# Altium schematic sheet EFR32_IO.SchDoc: IO Connections
size Letter; Author: Parth Thakkar; Organization: Low Self Esteam; Revision: v1.0; SheetNumber: 3; SheetTotal: 6
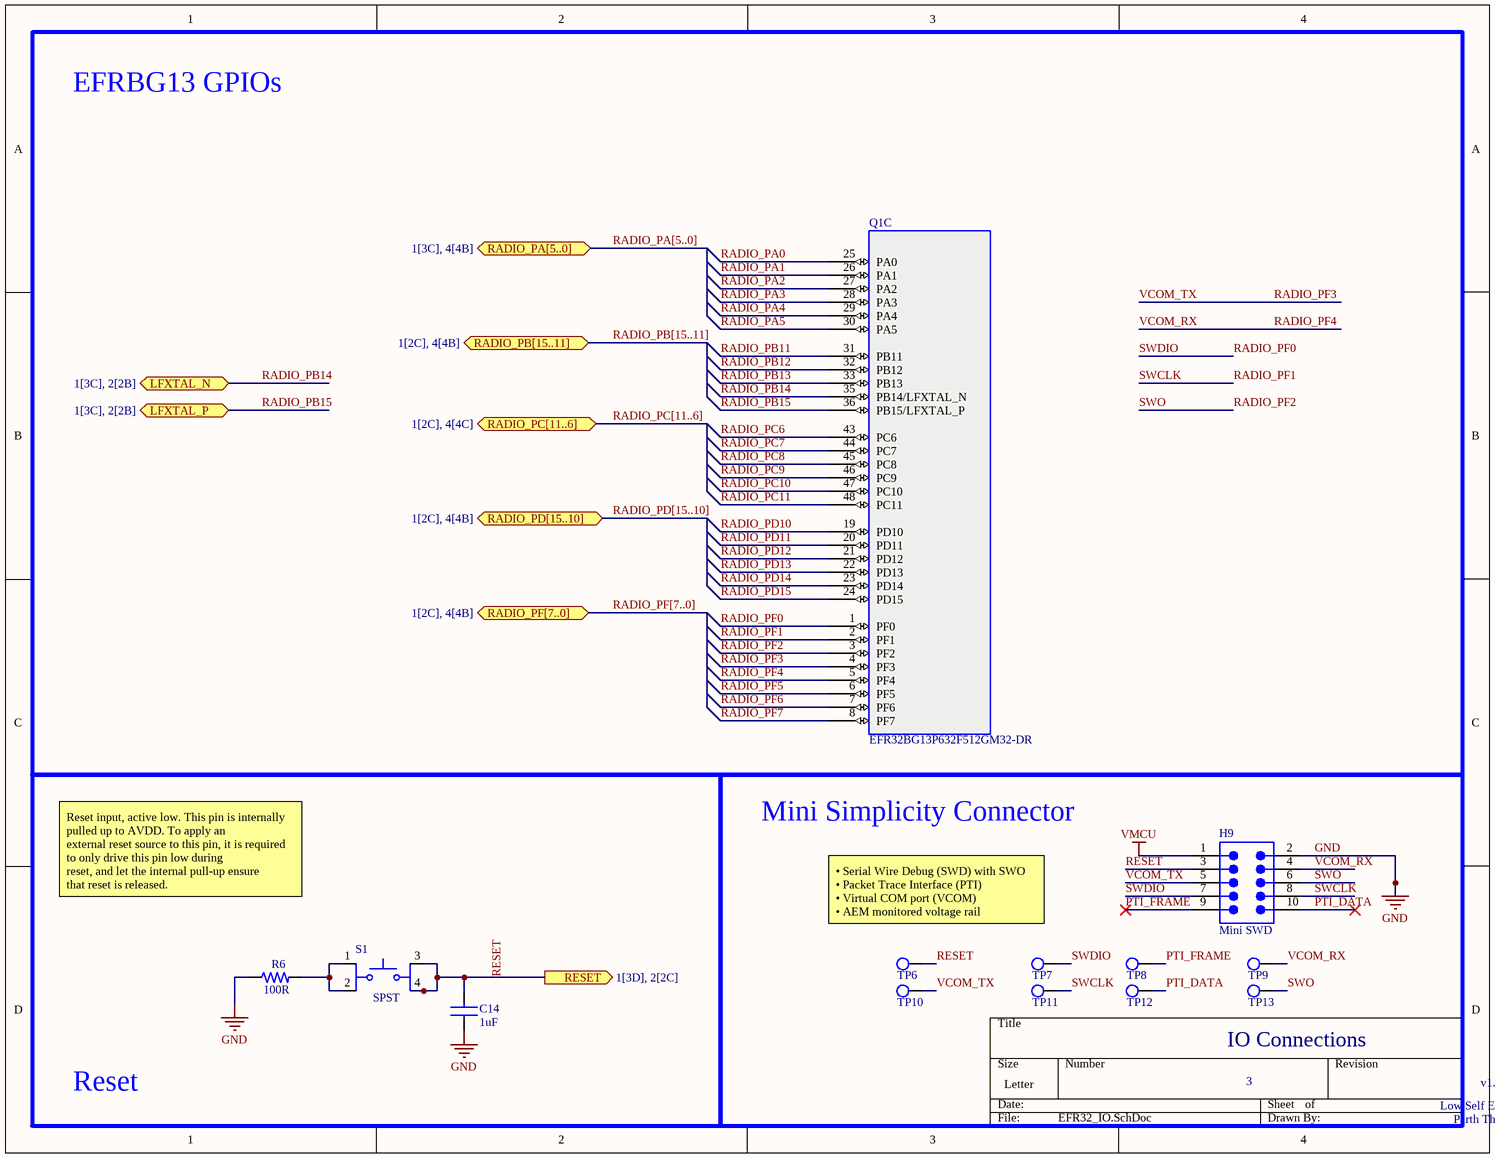
[diagram p0: EFR32_IO.SchDoc]

## Parts
C14  value 1uF  [Capacitor 0603]  (hidden comment: CAP 1uF 10V 0603)
H9  Mini SWD  [Mini Simplicity Connector]
Q1  EFR32BG13P632F512GM32-DR  [EFR32BG]  (part C of 3)
R6  value 100R  [Resistor 0603]  (hidden comment: RES 100R 0603)
S1  SPST  [SPST]
TP6  Test point  [Test Point]  (value not drawn)  (no BOM)
TP7  Test point  [Test Point]  (value not drawn)  (no BOM)
TP8  Test point  [Test Point]  (value not drawn)  (no BOM)
TP9  Test point  [Test Point]  (value not drawn)  (no BOM)
TP10  Test point  [Test Point]  (value not drawn)  (no BOM)
TP11  Test point  [Test Point]  (value not drawn)  (no BOM)
TP12  Test point  [Test Point]  (value not drawn)  (no BOM)
TP13  Test point  [Test Point]  (value not drawn)  (no BOM)

## Blocks framed on the sheet
EFRBG13 GPIOs: Q1
Reset: C14 R6 S1
Mini Simplicity Connector: H9 TP6-TP13

## Ports
LFXTAL_N (bidir, see 1[3C], 2[2B]), LFXTAL_P (bidir, see 1[3C], 2[2B]), RADIO_PA[5..0] (bidir, see 1[3C], 4[4B]), RADIO_PB[15..11] (bidir, see 1[2C], 4[4B]), RADIO_PC[11..6] (bidir, see 1[2C], 4[4C]), RADIO_PD[15..10] (bidir, see 1[2C], 4[4B]), RADIO_PF[7..0] (bidir, see 1[2C], 4[4B]), RESET (out, see 1[3D], 2[2C])

## Nets
GND: C14.2 H9.2 R6.1
VMCU: H9.1
PTI_DATA: H9.10 TP12.1
PTI_FRAME: H9.9 TP8.1
RADIO_PA0: Q1.25(PA0)
RADIO_PA1: Q1.26(PA1)
RADIO_PA2: Q1.27(PA2)
RADIO_PA3: Q1.28(PA3)
RADIO_PA4: Q1.29(PA4)
RADIO_PA5: Q1.30(PA5)
RADIO_PB11: Q1.31(PB11)
RADIO_PB12: Q1.32(PB12)
RADIO_PB13: Q1.33(PB13)
RADIO_PB14: Q1.35(PB14/LFXTAL_N) ; port LFXTAL_N
RADIO_PB15: Q1.36(PB15/LFXTAL_P) ; port LFXTAL_P
RADIO_PC6: Q1.43(PC6)
RADIO_PC7: Q1.44(PC7)
RADIO_PC8: Q1.45(PC8)
RADIO_PC9: Q1.46(PC9)
RADIO_PC10: Q1.47(PC10)
RADIO_PC11: Q1.48(PC11)
RADIO_PD10: Q1.19(PD10)
RADIO_PD11: Q1.20(PD11)
RADIO_PD12: Q1.21(PD12)
RADIO_PD13: Q1.22(PD13)
RADIO_PD14: Q1.23(PD14)
RADIO_PD15: Q1.24(PD15)
RADIO_PF0: H9.7 Q1.1(PF0) TP7.1  [also labelled SWDIO]
RADIO_PF1: H9.8 Q1.2(PF1) TP11.1  [also labelled SWCLK]
RADIO_PF2: H9.6 Q1.3(PF2) TP13.1  [also labelled SWO]
RADIO_PF3: H9.5 Q1.4(PF3) TP10.1  [also labelled VCOM_TX]
RADIO_PF4: H9.4 Q1.5(PF4) TP9.1  [also labelled VCOM_RX]
RADIO_PF5: Q1.6(PF5)
RADIO_PF6: Q1.7(PF6)
RADIO_PF7: Q1.8(PF7)
RESET: C14.1 H9.3 S1.3 S1.4 TP6.1 ; port RESET
NetR6_2: R6.2 S1.1 S1.2

## Buses and harness runs
bus RADIO_PA[5..0] = port RADIO_PA[5..0]
bus RADIO_PB[15..11] = port RADIO_PB[15..11]
bus RADIO_PC[11..6] = port RADIO_PC[11..6]
bus RADIO_PD[15..10] = port RADIO_PD[15..10]
bus RADIO_PF[7..0] = port RADIO_PF[7..0]

## Notes on the sheet
- Reset input, active low. This pin is internally
  pulled up to AVDD. To apply an
  external reset source to this pin, it is required
  to only drive this pin low during
  reset, and let the internal pull-up ensure
  that reset is released.
- • Serial Wire Debug (SWD) with SWO
  • Packet Trace Interface (PTI)
  • Virtual COM port (VCOM)
  • AEM monitored voltage rail

## Library data of the parts
C14 = CAP 1uF 10V 0603: Ceramic Capacitor, Multilayer, Ceramic, 10V, 10% +Tol, 10% -Tol, X5R, 15% TC, 1uF, Surface Mount, 0603; Manufacturer: Murata; Manufacturer Part Number: GRM188R61A105KA61D; Multilayer: Yes; Supplier: Digikey; Supplier Part Number: 490-1543-1-ND; RoHS: Yes; Category: Ceramic Capacitors; Stock: 2506225; Pricing: 1=0.1, 10=0.059, 50=0.0408, 100=0.0354, 500=0.0261, 1000=0.02321 (USD); Mounting Technology: Surface Mount; Pins: 2; Dielectric Material: Ceramic; Package Shape: Rectangular; Case/Package: 0603; Terminal Finish: Nickel; Min Operating Temperature: -55°C; Max Operating Temperature: 85°C; JESD-609 Code: e3; Capacitor Type: Ceramic; Tolerance  (fill in as +-): 10%; Package Style: SMTMeter; Packaging: Tape and Reel; Tolerance (fill in as +-): 10%; Rated DC Voltage (URdc): 10V; Temperature Characteristics Code: X5R; Termination: Wraparound; Length: 1.6mm; Width: 0.8mm; Height: 0.8mm; Reach SVHC Compliant: Yes; RoHS Compliant: Yes; ComponentLink1URL: https://psearch.en.murata.com:443/capacitor/product/GRM188R61A105KA61%23.pdf?src-supplier=IHS+Markit; ComponentLink1Description: https://psearch.en.murata.com:443/capacitor/product/GRM188R61A105KA61%23.pdf?src-supplier=IHS+Markit; ComponentLink2URL: https://datasheet.ciiva.com/18102/getdatasheetpartid-85467-18102910.pdf?src-supplier=Verical; ComponentLink2Description: https://datasheet.ciiva.com/18102/getdatasheetpartid-85467-18102910.pdf?src-supplier=Verical; ComponentLink3URL: https://datasheet.ciiva.com/19476/1857381-19476568.pdf?src-supplier=Jameco; ComponentLink3Description: https://datasheet.ciiva.com/19476/1857381-19476568.pdf?src-supplier=Jameco; ComponentLink4URL: https://datasheet.ciiva.com/7719/608985-7719036.pdf?src-supplier=Element14; ComponentLink4Description: https://datasheet.ciiva.com/7719/608985-7719036.pdf?src-supplier=Element14; ComponentLink5URL: https://datasheet.ciiva.com/22706/608985-22706782.pdf?src-supplier=Element14; ComponentLink5Description: https://datasheet.ciiva.com/22706/608985-22706782.pdf?src-supplier=Element14; ComponentLink6URL: https://datasheet.ciiva.com/131/partnumbering-e-01-131741.pdf?src-supplier=Digikey; ComponentLink6Description: https://datasheet.ciiva.com/131/partnumbering-e-01-131741.pdf?src-supplier=Digikey; ComponentLink7URL: https://datasheet.ciiva.com/131/partnumbering-e-01-131742.pdf?src-supplier=Digikey; ComponentLink7Description: https://datasheet.ciiva.com/131/partnumbering-e-01-131742.pdf?src-supplier=Digikey; ComponentLink8URL: https://datasheet.ciiva.com/131/partnumbering-e-01-131743.pdf?src-supplier=Digikey; ComponentLink8Description: https://datasheet.ciiva.com/131/partnumbering-e-01-131743.pdf?src-supplier=Digikey; ComponentLink9URL: https://datasheet.ciiva.com/16199/product-16199724.pdf?src-supplier=Future+Electronics; ComponentLink9Description: https://datasheet.ciiva.com/16199/product-16199724.pdf?src-supplier=Future+Electronics
H9 = Debug Connector Mini SWD - 0.05": Mini SWD 0.05" Pitch Connector - 10 Pin SMT Box Header; Manufacturer: Adafruit Industries; Manufacturer Part Number: 4048; Supplier 1: Digi-Key; RoHS: No; Category: Connectors; Stock 1: 201; Pricing 1: 1=1.95000 (USD); ComponentLink1URL: https://media.digikey.com/pdf/Data%20Sheets/Adafruit%20PDFs/4048_Web.pdf?src-supplier=Digi-Key; ComponentLink1Description: https://media.digikey.com/pdf/Data%20Sheets/Adafruit%20PDFs/4048_Web.pdf?src-supplier=Digi-Key
Q1 = EFR32BG13P632F512GM32-DR: BLue Gecko; Manufacturer: Silicon Labs; Supplier: Digikey; Supplier Part Number: 336-EFR32BG13P632F512GM32-DRCT-ND; Manufacturer Part Number: EFR32BG13P632F512GM32-DR; RoHS: No; Category: RF Receivers, Transceivers; Stock: 30445; Pricing: 1=6.93, 10=6.355, 25=5.7772, 100=5.1995, 250=4.7662, 500=4.3329, 1000=3.89961 (USD); RoHS Compliant: Yes; ComponentLink1URL: https://www.silabs.com/documents/login/data-sheets/efr32bg13-datasheet.pdf?src-supplier=Digikey; ComponentLink1Description: https://www.silabs.com/documents/login/data-sheets/efr32bg13-datasheet.pdf?src-supplier=Digikey
R6 = RES 100R 0603: Fixed Resistor, Metal Glaze/thick Film, 0.1W, 100ohm, 75V, 1% +/-Tol, 100ppm/Cel, Surface Mount, 0603; Manufacturer: Yageo; Manufacturer Part Number: RC0603FR-07100RL; Additional Feature: LASER TRIMMABLE; Power: 100mW; Rated Temperature: 70°C; Temperature Coefficient: 100ppm/°C; Package Height: 0.45mm; Package Length: 1.6mm; Package Width: 0.8mm; Supplier: Digikey; Supplier Part Number: 311-100HRCT-ND; RoHS: Yes; Category: Chip SMD Resistors; Stock: 2134400; Pricing: 1=0.1, 10=0.019, 50=0.0112, 100=0.0093, 500=0.00622, 1000=0.00532, 5000=0.00382, 10000=0.00335, 25000=0.00287, 35000=0.00278, 50000=0.00257, 125000=0.00232 (USD); Mounting Technology: Surface Mount; Pins: 2; Package Shape: Rectangular; Case/Package: 0603; Terminal Finish: Nickel; Min Operating Temperature: -55°C; Max Operating Temperature: 155°C; Tolerance: 1%; JESD-609 Code: e3; Resistor Type: FIXED RESISTOR; Construction: Chip; Package Style: SMTMeter; Packaging: Tape and Reel; Technology: METAL GLAZE/THICK FILM; Termination: Wraparound; Working Voltage: 75V; Reach SVHC Compliant: Yes; RoHS Compliant: Yes; ComponentLink1URL: https://datasheet.ciiva.com:443/pdfs/VipMasterIC/IC/YAGO/YAGO-S-A0008145938/YAGO-S-A0008145938-1.pdf?src-supplier=IHS+Markit; ComponentLink1Description: https://datasheet.ciiva.com:443/pdfs/VipMasterIC/IC/YAGO/YAGO-S-A0008145938/YAGO-S-A0008145938-1.pdf?src-supplier=IHS+Markit
S1 = SPST: Keypad Switch, 1 Switches, SPST, Momentary-tactile, 0.05A, 50VDC, 2.55N, Solder Terminal, Surface Mount-straight; Manufacturer: E-Switch; Manufacturer Part Number: TL3301NF260QG; Circuit Configuration: 1X1; Contact Current(DC)-Max: 50mA; Contact DC Max Rating R Load: .05A@50VDC; Contact Voltage(DC)-Max: 50V; Number of Switches: 1; Operating Force-Max: 3.04N; Body Breadth: 6inch; Body Height: 3.6mm; Body Length or Diameter: 6mm; Supplier: Digikey; Supplier Part Number: EG1868CT-ND; RoHS: Yes; Category: Tactile Switches; Stock: 45667; Pricing: 1=0.42, 10=0.404, 25=0.3804, 100=0.3303, 250=0.29968, 500=0.27876 (USD); Mounting Technology: Surface Mount; Terminal Finish: Silver; JESD-609 Code: e4; Packaging: Tape and Reel; Switch Action: MOMENTARY-TACTILE; Switch Function: SPST; Switch Type: Keypad; Termination: Solder; Reach SVHC Compliant: Yes; RoHS Compliant: Yes; ComponentLink1URL: https://datasheet.ciiva.com:443/pdfs/VipMasterIC/IC/ESCH/ESCH-S-A0005350531/ESCH-S-A0005350531-1.pdf?src-supplier=IHS+Markit; ComponentLink1Description: https://datasheet.ciiva.com:443/pdfs/VipMasterIC/IC/ESCH/ESCH-S-A0005350531/ESCH-S-A0005350531-1.pdf?src-supplier=IHS+Markit; ComponentLink2URL: https://datasheet.ciiva.com/2901/p010517e-2901296.pdf?src-supplier=Digikey; ComponentLink2Description: https://datasheet.ciiva.com/2901/p010517e-2901296.pdf?src-supplier=Digikey; ComponentLink3URL: https://datasheet.ciiva.com/2901/tl3301-2901294.pdf?src-supplier=Digikey; ComponentLink3Description: https://datasheet.ciiva.com/2901/tl3301-2901294.pdf?src-supplier=Digikey; ComponentLink4URL: https://datasheet.ciiva.com/2901/tl3301-2901295.pdf?src-supplier=Digikey; ComponentLink4Description: https://datasheet.ciiva.com/2901/tl3301-2901295.pdf?src-supplier=Digikey; ComponentLink5URL: https://datasheet.ciiva.com/7637/tl3301-7637661.pdf?src-supplier=Element14; ComponentLink5Description: https://datasheet.ciiva.com/7637/tl3301-7637661.pdf?src-supplier=Element14